# EAGLE design sdr_3157 (EAGLE 9.6.2)
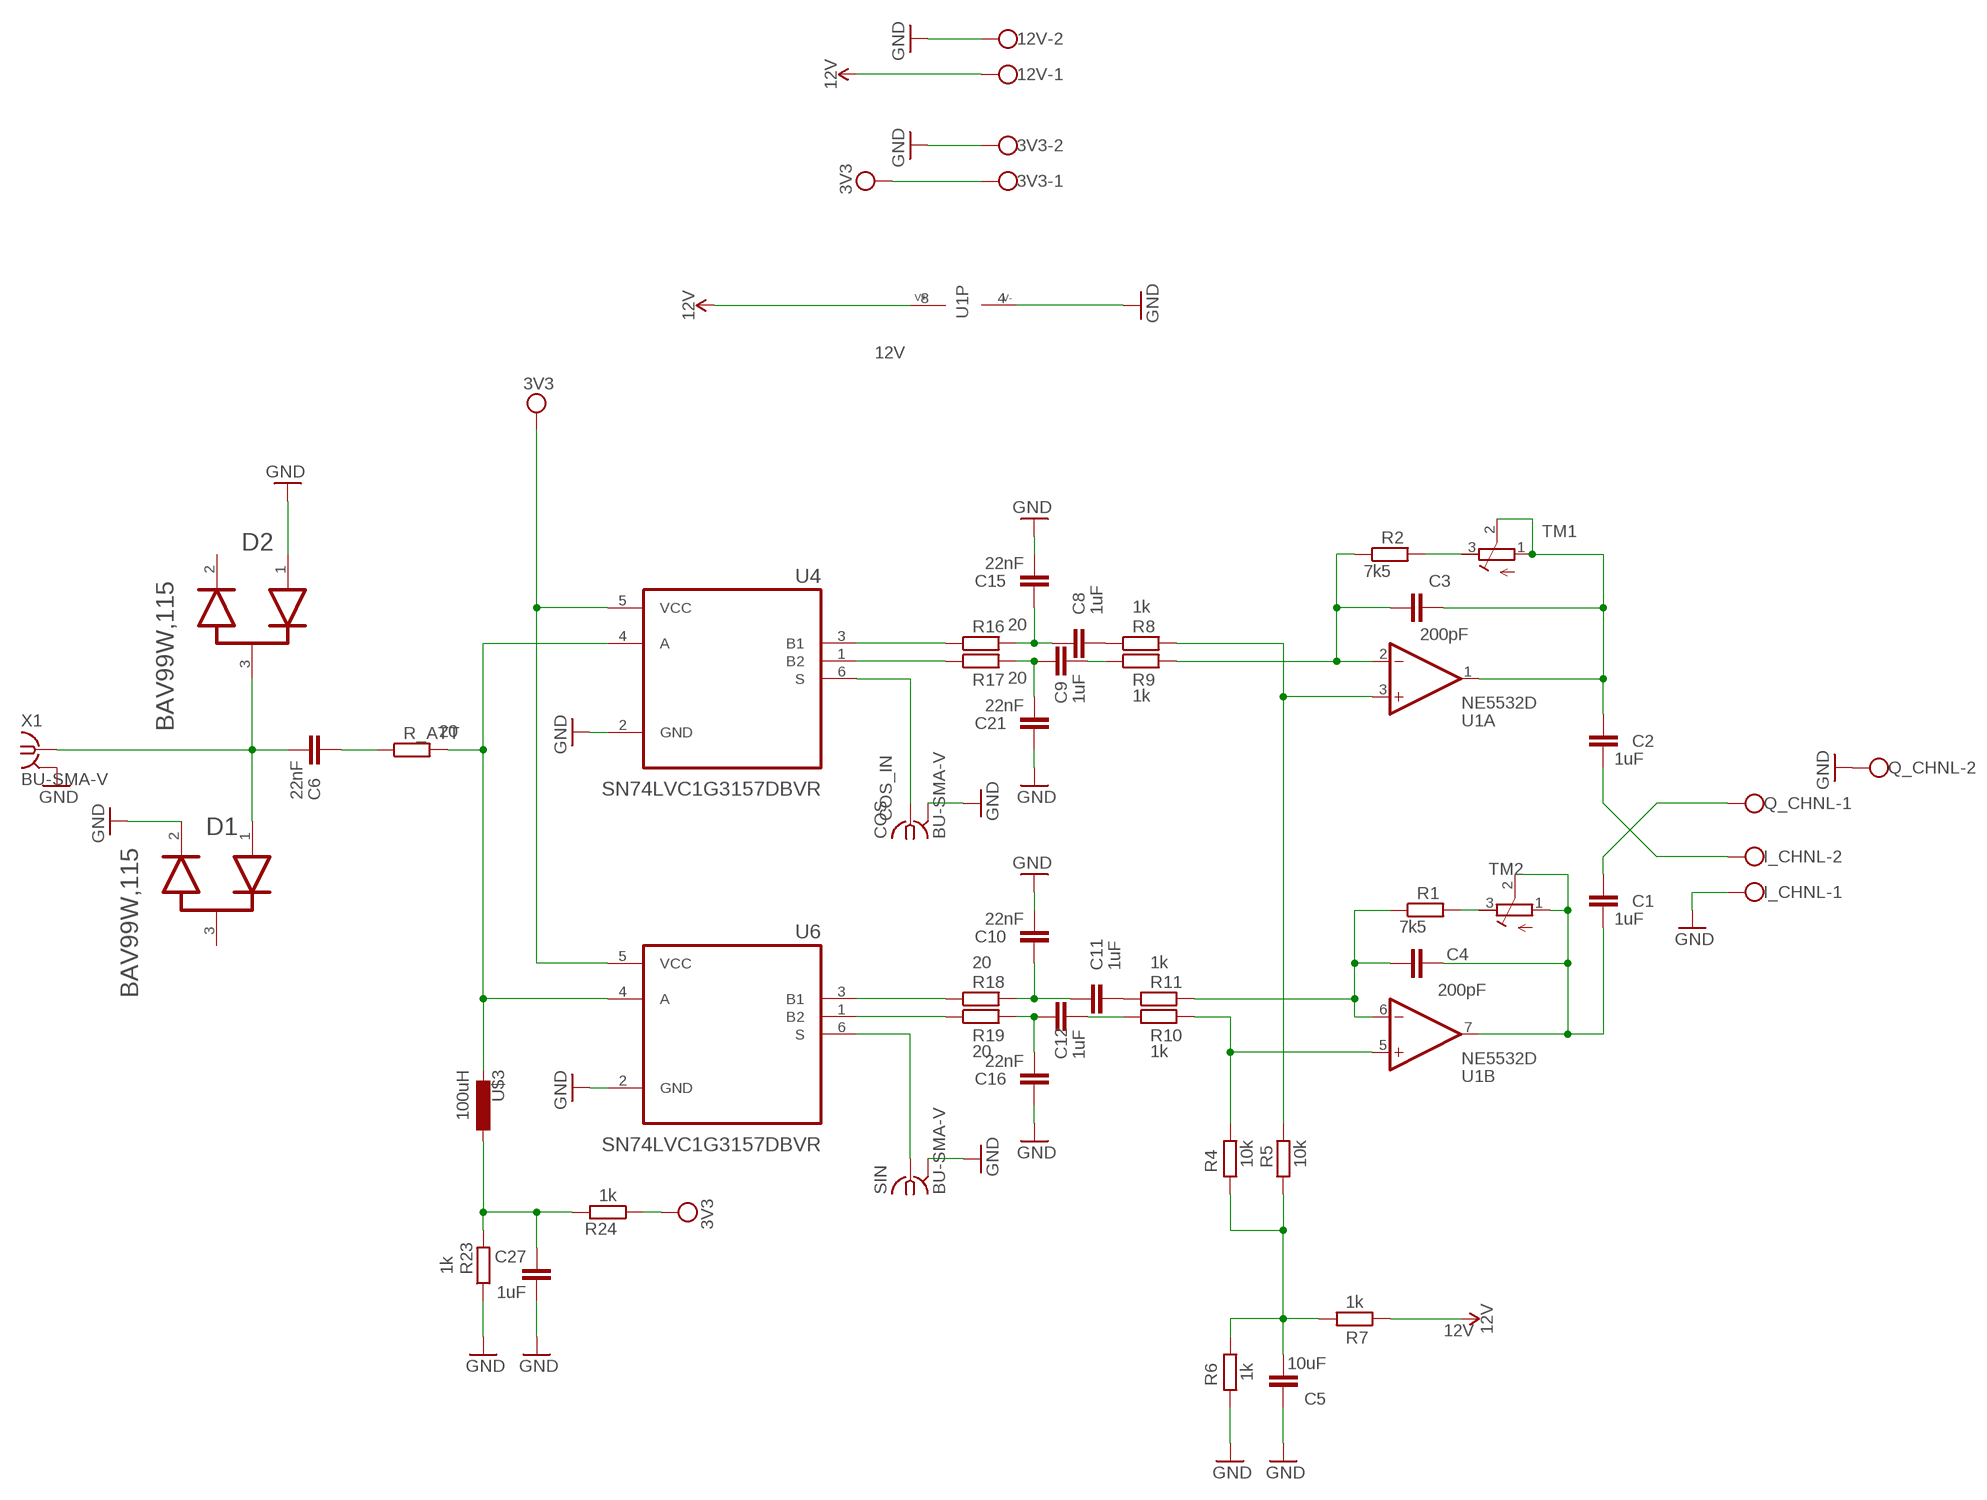
[diagram p0: schematic, sheet 1]

## Parts
3V3  W237-102  [W237-102]
12V  W237-102  [W237-102]
C1  1uF  C-EU050-045X075  [C050-045X075]
C2  1uF  C-EU050-045X075  [C050-045X075]
C3  200pF  C-EU050-045X075  [C050-045X075]
C4  200pF  C-EU050-045X075  [C050-045X075]
C5  10uF  C-EUC0805  [C0805]
C6  22nF  C-EUC1206K  [C1206K]
C8  1uF  C-EUC0805  [C0805]
C9  1uF  C-EUC0805  [C0805]
C10  22nF  C-EUC0805  [C0805]
C11  1uF  C-EUC0805  [C0805]
C12  1uF  C-EUC0805  [C0805]
C15  22nF  C-EUC0805  [C0805]
C16  22nF  C-EUC0805  [C0805]
C21  22nF  C-EUC0805  [C0805]
C27  1uF  C-EUC0805  [C0805]
COS  BU-SMA-V  [BU-SMA-V]
D1  NEXPERIA_BAV99W,115NEXPERIA_BAV99W,115_0_0  [NEXPERIA_BAV99W,115_0]
D2  NEXPERIA_BAV99W,115NEXPERIA_BAV99W,115_0_0  [NEXPERIA_BAV99W,115_0]
I_CHNL  W237-102  [W237-102]
Q_CHNL  W237-102  [W237-102]
R1  7k5  R-EU_R0805  [R0805]
R2  7k5  R-EU_R0805  [R0805]
R4  10k  R-EU_M0805  [M0805]
R5  10k  R-EU_R0805  [R0805]
R6  1k  R-EU_M0805  [M0805]
R7  1k  R-EU_M0805  [M0805]
R8  1k  R-EU_R0805  [R0805]
R9  1k  R-EU_R0805  [R0805]
R10  1k  R-EU_R0805  [R0805]
R11  1k  R-EU_M0805  [M0805]
R16  20  R-EU_R0805  [R0805]
R17  20  R-EU_R0805  [R0805]
R18  20  R-EU_R0805  [R0805]
R19  20  R-EU_R0805  [R0805]
R23  1k  R-EU_R0805  [R0805]
R24  1k  R-EU_R0805  [R0805]
R_ATT  20  R-EU_R1210  [R1210]
SIN  BU-SMA-V  [BU-SMA-V]
TM1  5k  R-TRIMM3296W  [RTRIM3296W]
TM2  5k  R-TRIMM3296W  [RTRIM3296W]
U1  NE5532D  [SO08]
U4  SN74LVC1G3157DBVR  [SOT95P280X145-6N]
U6  SN74LVC1G3157DBVR  [SOT95P280X145-6N]
U$3  100uH  L-EU0207/10  [0207/10]
X1  BU-SMA-V  [BU-SMA-V]

## Nets
12V: 12V.1 R7.1 U1.8(P:V+)
ANTENNA: R_ATT.2 U4.4(A) U6.4(A) U$3.2
COS_IN: COS.1 U4.6(S)
GND: 3V3.2 12V.2 C5.1 C10.2 C15.2 C16.1 C21.1 C27.1 COS.2 COS.3 COS.4 COS.5 D1.2(2_CATHODE) D2.1(1_ANODE) I_CHNL.1 Q_CHNL.2 R6.1 R23.1 SIN.2 SIN.3 SIN.4 SIN.5 U1.4(P:V-) U4.2(GND) U6.2(GND) X1.2 X1.3 X1.4 X1.5
N$1: C6.2 D1.1(1_ANODE) D2.3(1_CATHODE/2_ANODE) X1.1
N$2: C6.1 R_ATT.1
N$3: R16.1 U4.3(B1)
N$4: R17.1 U4.1(B2)
N$5: R18.1 U6.3(B1)
N$7: R19.1 U6.1(B2)
N$8: C8.1 C15.1 R16.2
N$9: C9.1 C21.2 R17.2
N$10: C10.1 C11.1 R18.2
N$11: C12.1 C16.2 R19.2
N$12: C8.2 R8.1
N$13: C9.2 R9.1
N$14: C11.2 R11.1
N$15: C12.2 R10.1
N$16: R5.2 R8.2 U1.3(A:+IN)
N$17: C3.1 R2.1 R9.2 U1.2(A:-IN)
N$18: R4.2 R10.2 U1.5(B:+IN)
N$19: C4.1 R1.1 R11.2 U1.6(B:-IN)
N$20: C5.2 R4.1 R5.1 R6.2 R7.2
N$21: C2.1 C3.2 TM1.1(A) TM1.2(S) U1.1(A:OUT)
N$22: C2.2 I_CHNL.2
N$23: C1.1 Q_CHNL.1
N$24: C1.2 C4.2 TM2.1(A) TM2.2(S) U1.7(B:OUT)
N$25: C27.2 R23.2 R24.2 U$3.1
N$28: R2.2 TM1.3(E)
N$41: R1.2 TM2.3(E)
SIN_IN: SIN.1 U6.6(S)
VCC: 3V3.1 R24.1 U4.5(VCC) U6.5(VCC) ; supply symbol labelled 3V3
Unconnected: D1.3(1_CATHODE/2_ANODE) D2.2(2_CATHODE)

## Library data of the parts
3V3 12V I_CHNL Q_CHNL = con-wago-500:W237-102: WAGO SCREW CLAMP; MPN: 237-102; OC_FARNELL: unknown; OC_NEWARK: 70K9898
C1-C6 C8-C12 C15 C16 C21 C27 = rcl:C-EU: CAPACITOR, European symbol; SPICEPREFIX: C
COS SIN X1 = con-coax:BU-SMA-V: FEMALE SMA CONNECTOR Radiall distributor RS 112-3794; OC_FARNELL: unknown; OC_NEWARK: unknown
D1 D2 = Nexperia - BAV99W,115:NEXPERIA_BAV99W,115: High-speed switching diodes; 3DS_PART_NUMBER: 412-00001; AMBIENT_TEMPERATURE_RANGE_HIGH: +150°C; AMBIENT_TEMPERATURE_RANGE_LOW: -65°C; CAPACITANCE: 1.5pF; CENTROID_NOT_SPECIFIED: No; DATASHEET: https://assets.nexperia.com/documents/data-sheet/BAV99_SER.pdf; DEVICE_CLASS_L1: Discrete Semiconductors; DEVICE_CLASS_L2: Diodes; DEVICE_CLASS_L3: Rectifier Diodes; DIGIKEY_DESCRIPTION: DIODE ARRAY GP 100V 150MA SOT323; DIGIKEY_PART_NUMBER: 1727-2915-1-ND; FOOTPRINT_PARAMETERS_0: {"fp_type":"SOT23","params":{"N":{"default":"3","long name":"Number of leads","type":"multichoice","short name":"N"},"A":{"nom":false,"long name":"Height","min":800000,"max":1100000,"short name":"A","type":"measurement"},"A1":{"nom":false,"long name":"Package clearance","min":false,"max":100000,"short name":"A1","type":"measurement"},"A2":{"nom":false,"long name":"Package height","min":false,"max":1000000,"short name":"A2","type":"measurement"},"D":{"nom":false,"long name":"Package length","min":1800000,"max":2200000,"short name":"D","type":"measurement"},"E":{"nom":false,"long name":"Width /w leads","min":2000000,"max":2200000,"short name":"E","type":"measurement"},"E1":{"nom":false,"long name":"Package width","min":1150000,"max":1350000,"short name":"E1","type":"measurement"},"B":{"nom":false,"long name":"Lead width","min":300000,"max":400000,"short name":"B","type":"measurement"},"C":{"nom":false,"long name":"Lead thickness","min":100000,"max":250000,"short name":"C","type":"measurement"},"L":{"nom":false,"long name":"Lead foot length","min":150000,"max":450000,"short name":"L","type":"measurement"},"e":{"nom":650000,"long name":"Lead pitch","min":null,"max":null,"short name":"e","type":"measurement"},"PHI":{"nom":false,"long name":"Lead angle","min":0,"max":8,"short name":"PHI","type":"measurement"},"offset x":{"nom":0,"long name":"X Center offset","min":null,"max":null,"short name":"offset x","type":"measurement"},"offset y":{"nom":0,"long name":"Y Center offset","min":null,"max":null,"short name":"offset y","type":"measurement"},"LS":{"default":"Rounded rectangle","long name":"Land shape","type":"multichoice","short name":"LS"},"LS1":{"default":"Rectangle","long name":"Land shape (Pin 1)","type":"multichoice","short name":"LS1"},"solder toe":{"nom":550000,"long name":"Solder fillet (toe)","min":null,"max":null,"short name":"solder toe","type":"fixedmeasurement"},"solder heel":{"nom":450000,"long name":"Solder fillet (heel)","min":null,"max":null,"short name":"solder heel","type":"fixedmeasurement"},"solder side":{"nom":50000,"long name":"Solder fillet (side)","min":null,"max":null,"short name":"solder side","type":"fixedmeasurement"},"courtyard":{"nom":500000,"long name":"Courtyard","min":null,"max":null,"short name":"courtyard","type":"fixedmeasurement"},"SF":{"default":"A","long name":"Packing level","type":"multichoiceparent","short name":"SF","help":"http://support.upverter.com/customer/portal/articles/978783-what-is-a-footprint-packing-level","children":["solder toe","solder heel","solder side","courtyard"]}}}; FOOTPRINT_PARAMETERS_1: {"fp_type":"SOT23","params":{"N":{"default":"3","long name":"Number of leads","type":"multichoice","short name":"N"},"A":{"nom":false,"long name":"Height","min":800000,"max":1100000,"short name":"A","type":"measurement"},"A1":{"nom":false,"long name":"Package clearance","min":false,"max":100000,"short name":"A1","type":"measurement"},"A2":{"nom":false,"long name":"Package height","min":false,"max":1000000,"short name":"A2","type":"measurement"},"D":{"nom":false,"long name":"Package length","min":1800000,"max":2200000,"short name":"D","type":"measurement"},"E":{"nom":false,"long name":"Width /w leads","min":2000000,"max":2200000,"short name":"E","type":"measurement"},"E1":{"nom":false,"long name":"Package width","min":1150000,"max":1350000,"short name":"E1","type":"measurement"},"B":{"nom":false,"long name":"Lead width","min":300000,"max":400000,"short name":"B","type":"measurement"},"C":{"nom":false,"long name":"Lead thickness","min":100000,"max":250000,"short name":"C","type":"measurement"},"L":{"nom":false,"long name":"Lead foot length","min":150000,"max":450000,"short name":"L","type":"measurement"},"e":{"nom":650000,"long name":"Lead pitch","min":null,"max":null,"short name":"e","type":"measurement"},"PHI":{"nom":false,"long name":"Lead angle","min":0,"max":8,"short name":"PHI","type":"measurement"},"offset x":{"nom":0,"long name":"X Center offset","min":null,"max":null,"short name":"offset x","type":"measurement"},"offset y":{"nom":0,"long name":"Y Center offset","min":null,"max":null,"short name":"offset y","type":"measurement"},"LS":{"default":"Rounded rectangle","long name":"Land shape","type":"multichoice","short name":"LS"},"LS1":{"default":"Rectangle","long name":"Land shape (Pin 1)","type":"multichoice","short name":"LS1"},"solder toe":{"nom":350000,"long name":"Solder fillet (toe)","min":null,"max":null,"short name":"solder toe","type":"fixedmeasurement"},"solder heel":{"nom":350000,"long name":"Solder fillet (heel)","min":null,"max":null,"short name":"solder heel","type":"fixedmeasurement"},"solder side":{"nom":30000,"long name":"Solder fillet (side)","min":null,"max":null,"short name":"solder side","type":"fixedmeasurement"},"courtyard":{"nom":250000,"long name":"Courtyard","min":null,"max":null,"short name":"courtyard","type":"fixedmeasurement"},"SF":{"default":"B","long name":"Packing level","type":"multichoiceparent","short name":"SF","help":"http://support.upverter.com/customer/portal/articles/978783-what-is-a-footprint-packing-level","children":["solder toe","solder heel","solder side","courtyard"]}}}; FOOTPRINT_PARAMETERS_2: {"fp_type":"SOT23","params":{"N":{"default":"3","long name":"Number of leads","type":"multichoice","short name":"N"},"A":{"nom":false,"long name":"Height","min":800000,"max":1100000,"short name":"A","type":"measurement"},"A1":{"nom":false,"long name":"Package clearance","min":false,"max":100000,"short name":"A1","type":"measurement"},"A2":{"nom":false,"long name":"Package height","min":false,"max":1000000,"short name":"A2","type":"measurement"},"D":{"nom":false,"long name":"Package length","min":1800000,"max":2200000,"short name":"D","type":"measurement"},"E":{"nom":false,"long name":"Width /w leads","min":2000000,"max":2200000,"short name":"E","type":"measurement"},"E1":{"nom":false,"long name":"Package width","min":1150000,"max":1350000,"short name":"E1","type":"measurement"},"B":{"nom":false,"long name":"Lead width","min":300000,"max":400000,"short name":"B","type":"measurement"},"C":{"nom":false,"long name":"Lead thickness","min":100000,"max":250000,"short name":"C","type":"measurement"},"L":{"nom":false,"long name":"Lead foot length","min":150000,"max":450000,"short name":"L","type":"measurement"},"e":{"nom":650000,"long name":"Lead pitch","min":null,"max":null,"short name":"e","type":"measurement"},"PHI":{"nom":false,"long name":"Lead angle","min":0,"max":8,"short name":"PHI","type":"measurement"},"offset x":{"nom":0,"long name":"X Center offset","min":null,"max":null,"short name":"offset x","type":"measurement"},"offset y":{"nom":0,"long name":"Y Center offset","min":null,"max":null,"short name":"offset y","type":"measurement"},"LS":{"default":"Rounded rectangle","long name":"Land shape","type":"multichoice","short name":"LS"},"LS1":{"default":"Rectangle","long name":"Land shape (Pin 1)","type":"multichoice","short name":"LS1"},"solder toe":{"nom":150000,"long name":"Solder fillet (toe)","min":null,"max":null,"short name":"solder toe","type":"fixedmeasurement"},"solder heel":{"nom":250000,"long name":"Solder fillet (heel)","min":null,"max":null,"short name":"solder heel","type":"fixedmeasurement"},"solder side":{"nom":10000,"long name":"Solder fillet (side)","min":null,"max":null,"short name":"solder side","type":"fixedmeasurement"},"courtyard":{"nom":100000,"long name":"Courtyard","min":null,"max":null,"short name":"courtyard","type":"fixedmeasurement"},"SF":{"default":"C","long name":"Packing level","type":"multichoiceparent","short name":"SF","help":"http://support.upverter.com/customer/portal/articles/978783-what-is-a-footprint-packing-level","children":["solder toe","solder heel","solder side","courtyard"]}}}; FOOTPRINT_URL: https://assets.nexperia.com/documents/outline-drawing/SOT323.pdf; FOOTPRINT_VARIANT_NAME_0: IPC_A; FOOTPRINT_VARIANT_NAME_1: IPC_B; FOOTPRINT_VARIANT_NAME_2: IPC_C; FOOTPRINT_VARIANT_NAME_3: Recommended_Land_Pattern; FORWARD_CURRENT: 130mA; HEIGHT: 1.1mm; IPC_LAND_PATTERN_NAME: SOT65P210X95-3; LEAD_FREE: yes; MAX_JUNCTION_TEMP: +150°C; MAX_REPETITIVE_REVERSE_VOLTAGE: 100V; MAX_SURGE_FORWARD_CURRENT: 4A; MF: Nexperia; MFG_PACKAGE_IDENT: SOT323; MFG_PACKAGE_IDENT_DATE: 01/2017; MFG_PACKAGE_IDENT_REV: 0; MOUSER_DESCRIPTION: Diodes - General Purpose, Power, Switching SW DBL 75V 150MA HS; MOUSER_PART_NUMBER: 771-BAV99W-T/R; MPN: BAV99W,115; PACKAGE: SOT-323; PEAK_REVERSE_CURRENT: 500mA; PREFIX: D; REVERSE_VOLTAGE: 100V; ROHS: yes; STANDOFF_HEIGHT: 0.1mm; TEMPERATURE_RANGE_HIGH: +150°C; TEMPERATURE_RANGE_LOW: -65°C; VERIFICATION_VERSION: 0.0.0.1
R1 R2 R4-R11 R16-R19 R23 R24 R_ATT = rcl:R-EU_: RESISTOR, European symbol; SPICEPREFIX: R
TM1 TM2 = rcl:R-TRIMM: Trimm resistor; SPICEMODEL: X; SPICEPREFIXL: POT
U1 = op-amp:NE5532: OP-AMP
U4 U6 = SN74LVC1G3157DBVR:SN74LVC1G3157DBVR: Check prices <https://pricing.snapeda.com/parts/SN74LVC1G3157DBVR/Texas%20Instruments/view-part?ref=eda>; AVAILABILITY: In Stock; DESCRIPTION: 5-V, 2:1 (SPDT), 1-channel general-purpose analog switch 6-SOT-23 -40 to 125; MF: Texas Instruments; MP: SN74LVC1G3157DBVR; PACKAGE: SOT-23-6 Texas Instruments; PRICE: None; PURCHASE-URL: https://pricing.snapeda.com/search/part/SN74LVC1G3157DBVR/?ref=eda
U$3 = rcl:L-EU: INDUCTOR, European symbol; SPICEPREFIX: L

## Board
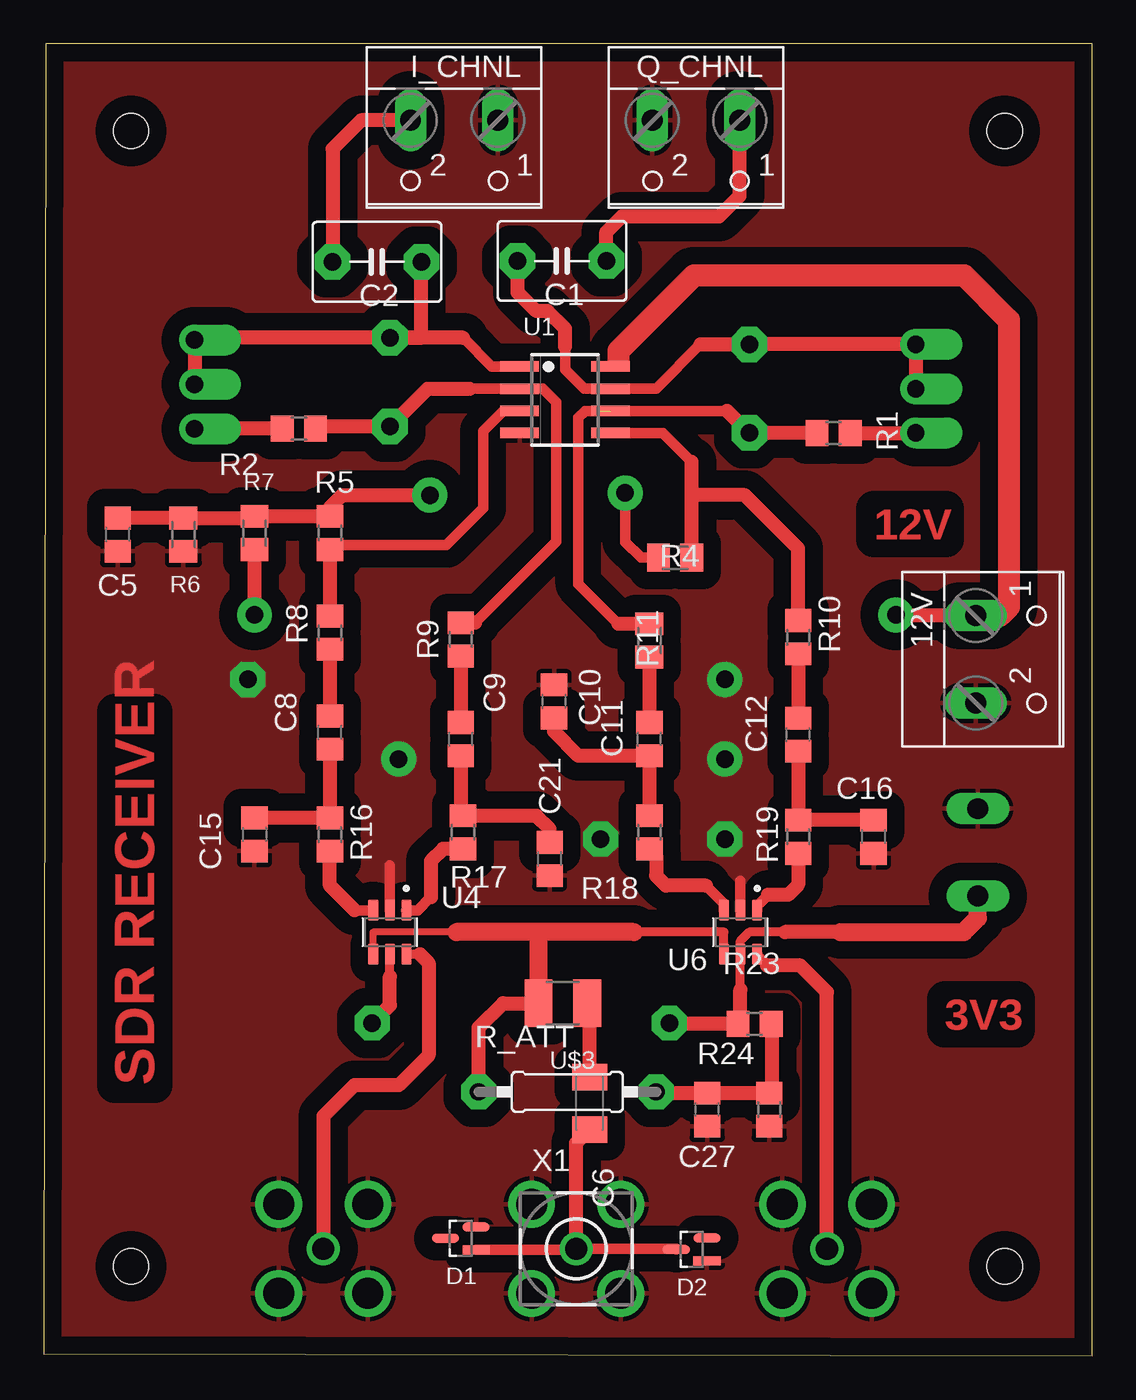
[diagram p1: board, top side]
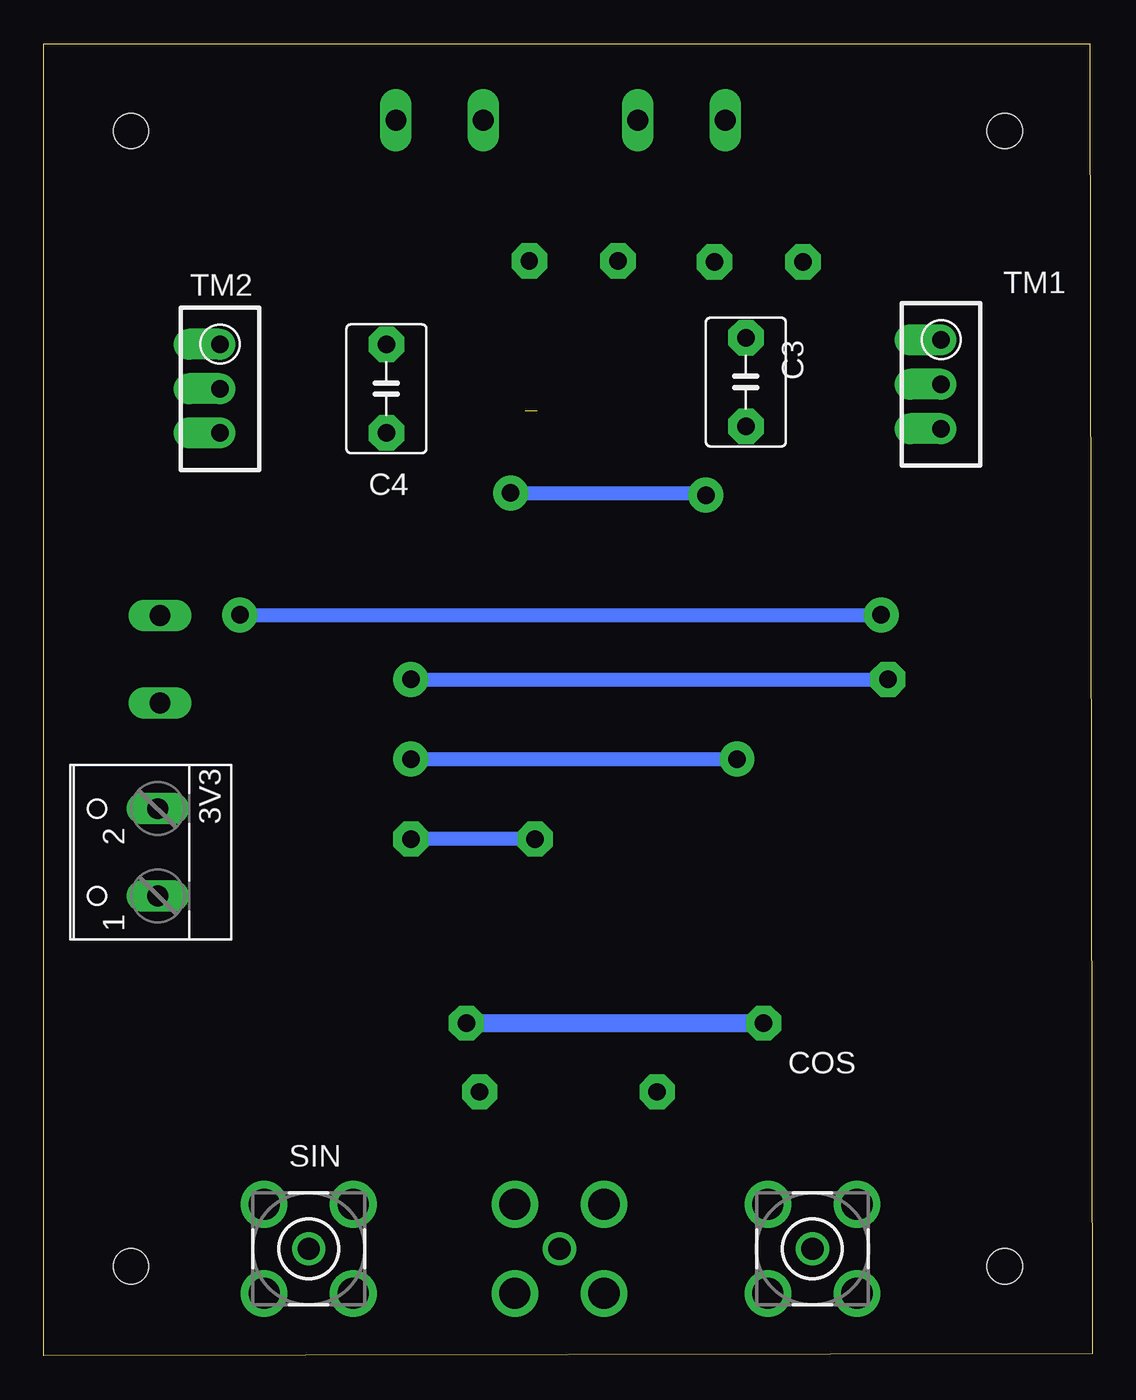
[diagram p2: board, bottom side, seen from below]

Size 60 x 75.13 mm. Coordinates in mm from the lower left corner, seen from the top.
Outline: 0,0.13 60,0 60,75.13 0.13,75.13 0,0.13
Copper layers (1*16): Top 0.035mm / dielectric 1.5mm / Bottom 0.035mm
Design rules "default": minimum track width 6mil, minimum drill 0.35mm, track to track 6mil, track to pad 6mil, pad to pad 6mil, via to via 6mil, smd to smd 6mil, copper to edge 40mil, drill to drill 6mil, minimum pad ring 10mil, minimum via ring 8mil, stop-mask expansion 4mil, vias tented up to drill 0mil, thermal gap 10mil
Holes 2 mm at 5,5.13 5,70.13 55,70.13 55,5.13

### Footprints (pad centres in the part's own frame; a part is rotated, then mirrored left to right if it is on the bottom)
W237-102 = drill 1.194 long: 1 -2.5,-1.27; 2 2.5,-1.27
C050-045X075 = drill 1 pad 2.032 octagon: 1 -2.54,0; 2 2.54,0
C0805 = smd 1.3 x 1.5: 1 -0.95,0; 2 0.95,0
C1206K = smd 1.5 x 2: 1 -1.5,0; 2 1.5,0
BU-SMA-V = drill 1.27: 1 0,0 | drill 1.778: 2 -2.55,2.55; 3 2.55,2.55; 4 2.55,-2.55; 5 -2.55,-2.55
NEXPERIA_BAV99W,115_0 = smd 1.559 x 0.522: 1 -0.877,0.65; 2 -0.877,-0.65; 3 0.877,0
R0805 = smd 1.3 x 1.5: 1 -0.95,0; 2 0.95,0
M0805 = smd 1.3 x 1.6: 1 -0.95,0; 2 0.95,0
R1210 = smd 1.6 x 2.7: 1 -1.4,0; 2 1.4,0
RTRIM3296W = drill 1 pad 1.778 offset: 1 0,-2.54; 2 0,0; 3 0,2.54
SO08 = smd 0.6 x 2.2: 1 -1.905,-2.6; 2 -0.635,-2.6; 3 0.635,-2.6; 4 1.905,-2.6; 5 1.905,2.6; 6 0.635,2.6; 7 -0.635,2.6; 8 -1.905,2.6
SOT95P280X145-6N = smd 1.21 x 0.58: 1 -1.255,0.95; 2 -1.255,0; 3 -1.255,-0.95; 4 1.255,-0.95; 5 1.255,0; 6 1.255,0.95
0207/10 = drill 1 pad 2 octagon: 1 -5.08,0; 2 5.08,0

### Placement (x,y rotation side)
3V3  54.74,28.83 90 bottom
12V  54.61,39.88 270 top
C1  29.67,62.69 180 top
C2  19.08,62.64 180 top
C3  19.81,55.75 90 bottom
C4  40.39,55.37 90 bottom
C5  4.24,47.02 90 top
C6  31.24,14.45 270 top
C8  16.38,35.69 90 top
C9  23.88,35.31 90 top
C10  29.21,37.47 90 top
C11  34.67,35.31 90 top
C12  43.18,35.56 90 top
C15  12.06,29.84 270 top
C16  47.5,29.72 90 top
C21  28.96,28.45 90 top
C27  37.97,14.1 90 top
COS  16,6.13 0 bottom
D1  23.88,6.73 180 top
D2  37.08,6.1 180 top
I_CHNL  23.5,69.47 180 top
Q_CHNL  37.34,69.47 180 top
R1  45.21,52.83 0 top
R2  14.61,53.09 180 top
R4  36.14,45.69 0 top
R5  16.38,47.12 270 top
R6  8,47.02 90 top
R7  12.06,47.12 90 top
R8  16.38,41.4 90 top
R9  23.88,41.02 90 top
R10  43.18,41.15 90 top
R11  34.67,40.96 90 top
R16  16.38,29.84 90 top
R17  24,29.97 90 top
R18  34.67,29.97 90 top
R19  43.18,29.72 90 top
R23  41.53,14.1 90 top
R24  40.69,19 0 top
R_ATT  29.72,20.19 180 top
SIN  44.83,6.13 0 bottom
TM1  8.64,55.63 180 bottom
TM2  49.91,55.37 180 bottom
U1  29.84,54.74 270 top
U4  19.81,24.26 270 top
U6  39.88,24.26 270 top
U$3  29.97,15.11 180 top
X1  30.48,6.13 0 top

### Tracks (layer width: path | path; a pad name or v marks a point on that pad's centre or on a via)
12V  (via drill 1 pad 2)
  Top 0.61: 32.89,57.02 32.83,57.02 U1.8
  Top 0.813: 12V.1 48.81,42.38 v48.77,42.42 | R7.1 v12.06,42.42
  Top 1.27: 32.89,57.02 32.89,57.53 37.21,61.85 52.7,61.85 55.24,59.31 55.24,42.89 54.74,42.38 12V.1
  Bottom 0.813: v48.77,42.42 v12.06,42.42
ANTENNA
  Top 0.406: U4.4 18.86,24.26 23.62,24.26
  Top 0.508: U6.4 38.93,24.26 33.78,24.26
  Top 0.813: U$3.2 24.89,18.8 26.29,20.19 R_ATT.2
  Top 1.016: 33.78,24.26 28.32,24.26 | 28.32,24.26 23.62,24.26 | R_ATT.2 28.32,24.26
COS_IN
  Top 0.508: U4.6 21.52,23
  Top 0.813: 21.52,23 22.03,22.49 22.03,17.21 20.32,15.49 17.78,15.49 16,13.72 COS.1
GND  (via drill 1 pad 2)
  Top 0.61: U6.2 39.88,27.18 | U4.2 19.81,28.07
  Bottom 0.813: v38.99,38.73 v11.68,38.73 | v31.88,29.59 v38.99,29.59 | v38.99,34.16 v20.32,34.16
  pour Top (isolate 1.016): -2.29,77.85 -2.29,-2.79 61.72,-2.79 61.72,77.85
N$1
  Top 0.61: D2.3 36.21,6.13 X1.1 30.43,6.08 D1.1
  Top 0.813: C6.2 30.48,12.19 X1.1
N$2
  Top 0.813: C6.1 31.24,19.91 31.32,19.99
  Top 1.016: 31.32,19.99 R_ATT.1
N$3
  Top 0.61: U4.3 17.8,25.51
  Top 0.813: 17.8,25.51 16.38,26.92 R16.1
N$4
  Top 0.61: 22.16,26.27 21.4,25.51 U4.1
  Top 0.813: R17.1 22.86,29.02 22.16,28.32 22.16,26.27
N$5
  Top 0.61: R18.1 35.05,28.64 | U6.3 38.93,25.89 37.9,26.92
  Top 0.813: 35.05,28.64 35.05,27.48 35.61,26.92 37.9,26.92
N$7
  Top 0.61: U6.1 40.83,25.77 41.46,26.4
  Top 0.813: R19.1 43.18,26.97 42.61,26.4 41.46,26.4
N$8
  Top 0.813: C15.1 R16.2 C8.1
N$9
  Top 0.508: R17.2 23.88,31.05
  Top 0.813: C21.2 28.96,30.16 28.19,30.92 R17.2 | C9.1 23.88,31.05
N$10
  Top 0.813: R18.2 C11.1 30.61,34.36 29.21,35.75 C10.1
N$11
  Top 0.813: C12.1 R19.2 C16.2
N$12
  Top 0.813: R8.1 C8.2
N$13
  Top 0.813: R9.1 C9.2
N$14
  Top 0.813: R11.1 C11.2
N$15
  Top 0.813: R10.1 C12.2
N$16
  Top 0.61: R5.2 16.64,46.42 23.04,46.42 25.15,48.52 25.15,52.96 26.29,54.1 U1.3
  Top 0.813: R5.2 R8.2
N$17
  Top 0.61: 15.55,53.44 R2.1 15.68,53.21 | 24.38,55.37 U1.2 28.57,55.37 29.34,54.61 29.34,46.61 24.7,41.97 | 19.81,52.71 C3.1
  Top 0.813: 15.68,53.21 C3.1 21.97,55.37 24.38,55.37 | 24.7,41.97 R9.2
N$18
  Top 0.61: 37.08,51.18 35.43,52.83 U1.5 | 37.09,49.27 37.08,49.28
  Top 0.813: R10.2 43.18,46.23 40.13,49.28 37.08,49.28 37.08,51.18 | R4.2 37.09,49.27
N$19  (1 unrouted)
  Top 0.61: 32.89,41.91 30.61,44.2 30.61,53.72 30.99,54.1 31.75,54.1 | U1.6 39.12,54.1
  Top 0.813: R11.2 32.89,41.91 | 39.12,54.1 C4.1 R1.1
N$20  (via drill 1 pad 2)
  Top 0.61: R5.1 16.44,48.07 | R4.1 34.19,45.7 33.29,46.59 33.29,49.39
  Top 0.813: C5.2 R6.2 11.96,47.97 R7.2 R5.1 16.38,48.58 17.08,49.28 v22.1,49.28 | 33.29,49.39 v33.27,49.4
  Bottom 0.406: 22.23,49.4 v22.1,49.28
  Bottom 0.813: v33.27,49.4 22.23,49.4
N$21
  Top 0.61: U1.1 25.65,56.64 24,58.29
  Top 0.813: 24,58.29 C3.2 | C3.2 8.76,58.29 TM1.1 | TM1.1 TM1.2 | 8.66,58.17 TM1.1 | C3.2 21.59,58.29 21.59,62.61 C2.1
N$22
  Top 0.813: I_CHNL.2 18.16,70.74 16.54,69.11 C2.2
N$23
  Top 0.813: C1.1 32.21,64.34 33.1,65.23 38.64,65.23 39.84,66.42 Q_CHNL.1
N$24
  Top 0.61: 37.59,57.91 35.05,55.37 U1.7 30.94,55.37 29.84,56.46 29.84,57.79
  Top 0.813: C1.2 27.13,60.88 28.19,59.82 28.83,59.82 29.84,58.8 29.84,57.79 | 37.59,57.91 C4.2 TM2.1 TM2.2
N$25
  Top 0.813: U$3.1 35.12,15.05 C27.2 R23.2 41.66,15.17 41.66,18.98 R24.2
N$28
  Top 0.813: R2.2 TM1.3
N$41
  Top 0.61: R1.2 46.45,52.55
  Top 0.813: R1.2 TM2.3
SIN_IN
  Top 0.61: 41.4,22.35 40.83,22.93 U6.6
  Top 0.813: SIN.1 44.83,20.83 43.31,22.35 41.4,22.35
VCC  (via drill 1 pad 2)
  Top 0.406: v35.81,19.05 39.88,19.05
  Top 0.508: 19.81,21.72 U4.5 | 42.42,24.26 40.39,24.26 39.88,23.75 U6.5 39.88,20.95
  Top 0.813: v35.81,19.05 35.87,19 R24.1 39.88,19.14 39.88,20.95 | 45.59,24.26 42.42,24.26 | v18.8,19.05 19.81,20.07 19.81,21.72
  Top 1.016: 45.59,24.26 52.66,24.26 53.47,25.06 3V3.1
  Bottom 1.016: v35.81,19.05 v18.8,19.05

### Text on the board
Top: 12V | 3V3 | SDR RECEIVER